# EAGLE design VCO-40106 (EAGLE 9.2.0)
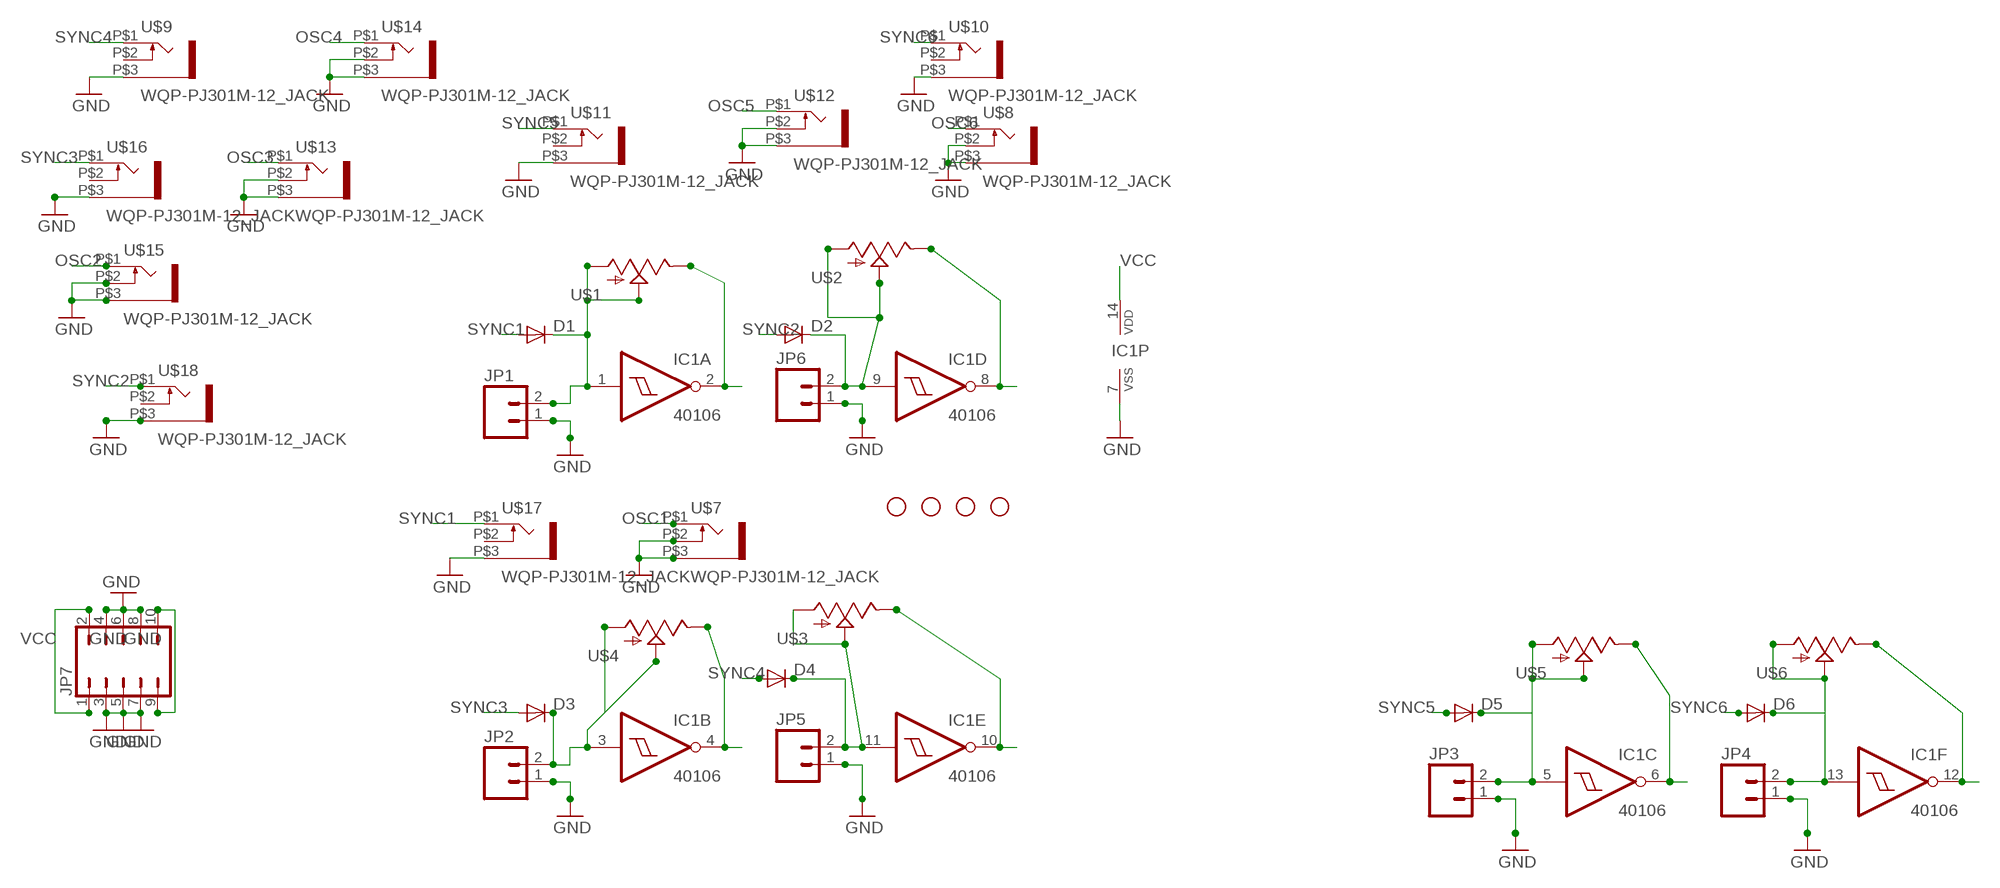
[diagram p0: schematic, sheet 1]

## Parts
D1  DIODE1N4148  [DIODE-1N4148]
D2  DIODE1N4148  [DIODE-1N4148]
D3  DIODE1N4148  [DIODE-1N4148]
D4  DIODE1N4148  [DIODE-1N4148]
D5  DIODE1N4148  [DIODE-1N4148]
D6  DIODE1N4148  [DIODE-1N4148]
IC1  40106  40106N  [DIL14]
JP1  M02  [1X02_LONGPADS]
JP2  M02  [1X02_LONGPADS]
JP3  M02  [1X02_LONGPADS]
JP4  M02  [1X02_LONGPADS]
JP5  M02  [1X02_LONGPADS]
JP6  M02  [1X02_LONGPADS]
JP7  JP5Q  [JP5Q]
JP8  STAND-OFF  [STAND-OFF]
JP9  STAND-OFF  [STAND-OFF]
JP10  STAND-OFF  [STAND-OFF]
JP11  STAND-OFF  [STAND-OFF]
U$1  POT  [ALPS_POT]
U$2  POT  [ALPS_POT]
U$3  POT  [ALPS_POT]
U$4  POT  [ALPS_POT]
U$5  POT  [ALPS_POT]
U$6  POT  [ALPS_POT]
U$7  WQP-PJ301M-12_JACK  [WQP-PJ301M-12_JACK]
U$8  WQP-PJ301M-12_JACK  [WQP-PJ301M-12_JACK]
U$9  WQP-PJ301M-12_JACK  [WQP-PJ301M-12_JACK]
U$10  WQP-PJ301M-12_JACK  [WQP-PJ301M-12_JACK]
U$11  WQP-PJ301M-12_JACK  [WQP-PJ301M-12_JACK]
U$12  WQP-PJ301M-12_JACK  [WQP-PJ301M-12_JACK]
U$13  WQP-PJ301M-12_JACK  [WQP-PJ301M-12_JACK]
U$14  WQP-PJ301M-12_JACK  [WQP-PJ301M-12_JACK]
U$15  WQP-PJ301M-12_JACK  [WQP-PJ301M-12_JACK]
U$16  WQP-PJ301M-12_JACK  [WQP-PJ301M-12_JACK]
U$17  WQP-PJ301M-12_JACK  [WQP-PJ301M-12_JACK]
U$18  WQP-PJ301M-12_JACK  [WQP-PJ301M-12_JACK]

## Nets
GND: IC1.7(P:VSS) JP1.1 JP2.1 JP3.1 JP4.1 JP5.1 JP6.1 JP7.3 JP7.4 JP7.5 JP7.6 JP7.7 JP7.8 U$7.P$2 U$7.P$3 U$8.P$2 U$8.P$3 U$9.P$3 U$10.P$3 U$11.P$3 U$12.P$2 U$12.P$3 U$13.P$2 U$13.P$3 U$14.P$2 U$14.P$3 U$15.P$2 U$15.P$3 U$16.P$3 U$17.P$3 U$18.P$3
N$1: D1.C IC1.1(A:I) JP1.2 U$1.P$2(S) U$1.P$3(A)
N$3: D3.C IC1.3(B:I) JP2.2 U$4.P$2(S) U$4.P$3(A)
N$5: D5.C IC1.5(C:I) JP3.2 U$5.P$2(S) U$5.P$3(A)
N$6: JP7.9 JP7.10
N$7: D2.C IC1.9(D:I) JP6.2 U$2.P$2(S) U$2.P$3(A)
N$18: D4.C IC1.11(E:I) JP5.2 U$3.P$2(S) U$3.P$3(A)
N$22: D6.C IC1.13(F:I) JP4.2 U$6.P$2(S) U$6.P$3(A)
OSC1: IC1.2(A:O) U$1.P$1(E) U$7.P$1
OSC2: IC1.4(B:O) U$4.P$1(E) U$15.P$1
OSC3: IC1.6(C:O) U$5.P$1(E) U$13.P$1
OSC4: IC1.8(D:O) U$2.P$1(E) U$14.P$1
OSC5: IC1.10(E:O) U$3.P$1(E) U$12.P$1
OSC6: IC1.12(F:O) U$6.P$1(E) U$8.P$1
SYNC1: D1.A U$17.P$1
SYNC2: D2.A U$18.P$1
SYNC3: D3.A U$16.P$1
SYNC4: D4.A U$9.P$1
SYNC5: D5.A U$11.P$1
SYNC6: D6.A U$10.P$1
VCC: IC1.14(P:VDD) JP7.1 JP7.2
Unconnected: U$9.P$2 U$10.P$2 U$11.P$2 U$16.P$2 U$17.P$2 U$18.P$2

## Library data of the parts
D1-D6 = SparkFun:DIODE: Diode These are standard reverse protection diodes and small signal diodes. SMA package can handle up to about 1A. SOD-323 can handle about 200mA. What the SOD-323 package when ordering, there are some mfgs out there that are 5-pin packages.
IC1 = 40xx:40106: Hex SCHMITT TRIGGER
JP1-JP6 = SparkFun:M02: Header 2 Standard 2-pin 0.1" header. Use with straight break away headers (SKU : PRT-00116), right angle break away headers (PRT-00553), swiss pins (PRT-00743), machine pins (PRT-00117), and female headers (PRT-00115). Molex polarized connector foot print use with SKU : PRT-08233 with associated crimp pins and housings.
JP7 = jumper:JP5Q: JUMPER
JP8-JP11 = SparkFun:STAND-OFF: Stand Off This is the mechanical footprint for a #4 phillips button head screw. Use the keepout ring to avoid running the screw head into surrounding components. SKU : PRT-00447
U$1-U$6 = SparkFun:POT
U$7-U$18 = thonkiconn:WQP-PJ301M-12_JACK

## Board
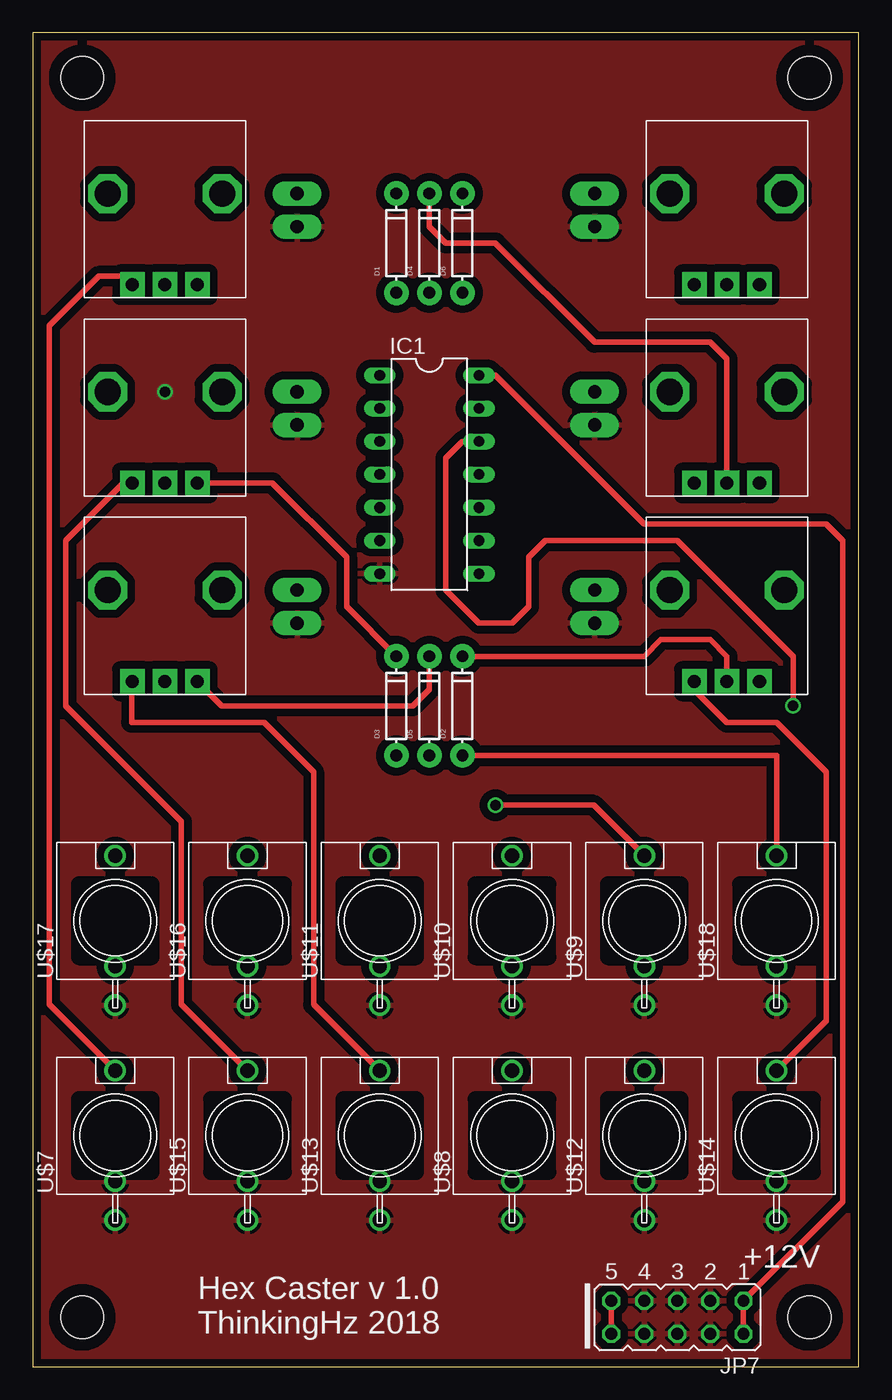
[diagram p1: board, top side]
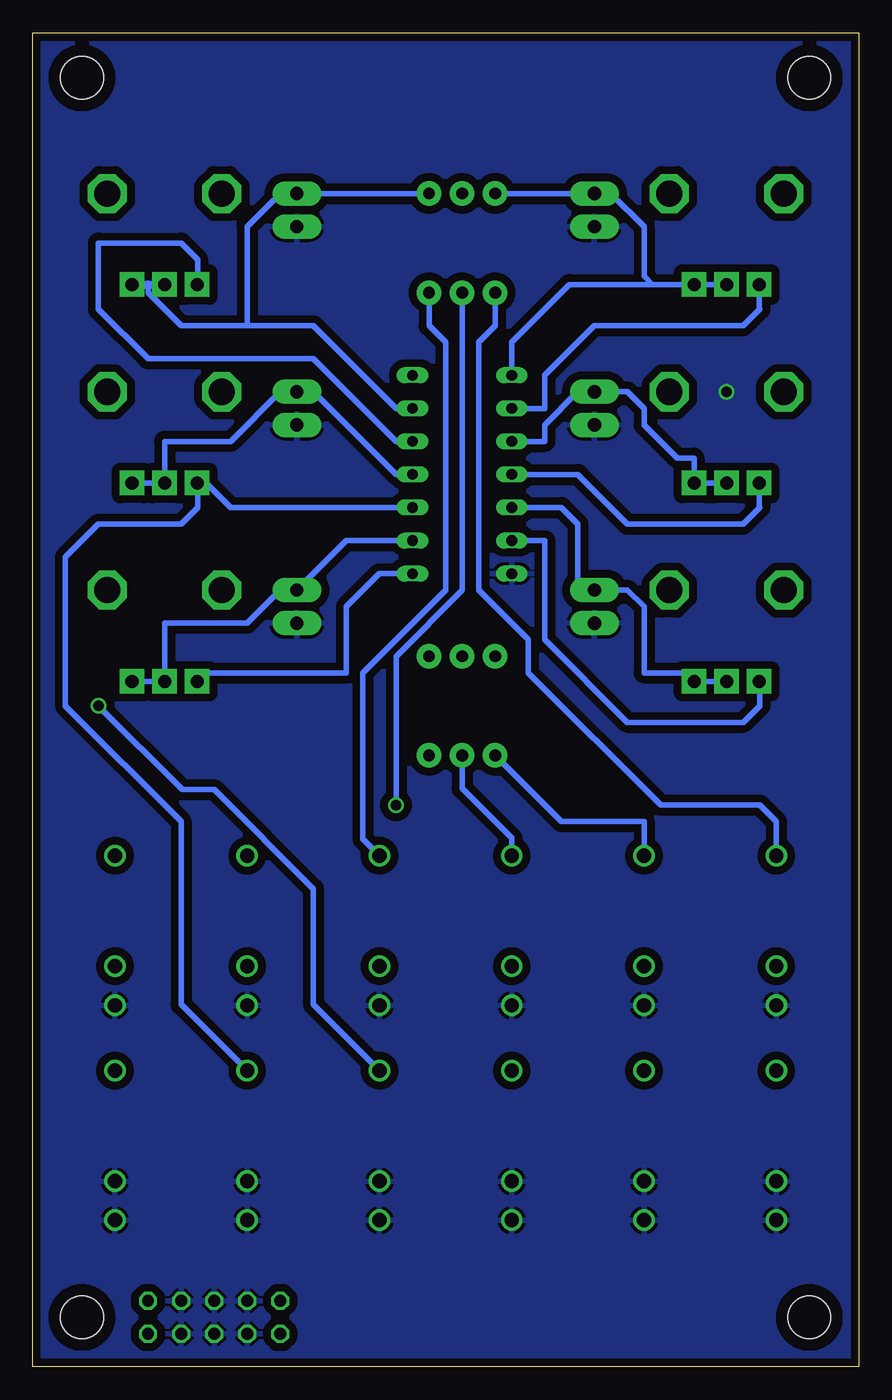
[diagram p2: board, bottom side, seen from below]

Size 63.48 x 102.54 mm. Coordinates in mm from the lower left corner, seen from the top.
Outline: 0,0 63.48,0 63.48,102.54 0,102.54 0,0
Copper layers (1*16): Top 0.035559375mm / dielectric 1.6mm / Bottom 0.035559375mm
Design rules "oshpark-2layer": minimum track width 6mil, minimum drill 10mil, track to track 6mil, track to pad 6mil, pad to pad 6mil, via to via 6mil, smd to smd 6mil, copper to edge 15mil, drill to drill 6mil, minimum pad ring 5mil, minimum via ring 5mil, stop-mask expansion 2.5mil, vias tented up to drill 0mil, thermal gap 10mil

### Footprints (pad centres in the part's own frame; a part is rotated, then mirrored left to right if it is on the bottom)
DIODE-1N4148 = drill 0.9 pad 1.88: A -3.81,0; C 3.81,0
DIL14 = drill 0.813 long: 1 -7.62,-3.81; 2 -5.08,-3.81; 3 -2.54,-3.81; 4 0,-3.81; 5 2.54,-3.81; 6 5.08,-3.81; 7 7.62,-3.81; 8 7.62,3.81; 9 5.08,3.81; 10 2.54,3.81; 11 0,3.81; 12 -2.54,3.81; 13 -5.08,3.81; 14 -7.62,3.81
1X02_LONGPADS = drill 1.016 pad 1.88 long: 1 0,0; 2 2.54,0
JP5Q = drill 0.914 octagon: 1 -5.08,-1.27; 2 -5.08,1.27; 3 -2.54,-1.27; 4 -2.54,1.27; 5 0,-1.27; 6 0,1.27; 7 2.54,-1.27; 8 2.54,1.27; 9 5.08,-1.27; 10 5.08,1.27
STAND-OFF = hole 3.302: 0,0
ALPS_POT = drill 1 pad 1.88 square: P$1 7,-2.5; P$2 7,0; P$3 7,2.5 | drill 2 octagon: P$4 0,-4.4; P$5 0,4.4
WQP-PJ301M-12_JACK = drill 1.1: P$1 0,5; P$2 0,-3.5; P$3 0,-6.5

### Placement (x,y rotation side)
D1  27.94,86.36 90 top
D2  33.02,50.8 90 top
D3  27.94,50.8 90 top
D4  30.48,86.36 90 top
D5  30.48,50.8 90 top
D6  33.02,86.36 90 top
IC1  30.48,68.58 270 top
JP1  20.32,87.63 90 top
JP2  20.32,72.39 90 top
JP3  20.32,57.15 90 top
JP4  43.18,87.63 90 top
JP5  43.18,72.39 90 top
JP6  43.18,57.15 90 top
JP7  49.53,3.81 180 top
JP8  3.81,3.81 0 top
JP9  59.69,3.81 0 top
JP10  3.81,99.06 0 top
JP11  59.69,99.06 0 top
U$1  10.16,90.17 270 top
U$2  53.34,59.69 270 top
U$3  53.34,74.93 270 top
U$4  10.16,74.93 270 top
U$5  10.16,59.69 270 top
U$6  53.34,90.17 270 top
U$7  6.35,17.78 0 top
U$8  36.83,17.78 0 top
U$9  46.99,34.29 0 top
U$10  36.83,34.29 0 top
U$11  26.67,34.29 0 top
U$12  46.99,17.78 0 top
U$13  26.67,17.78 0 top
U$14  57.15,17.78 0 top
U$15  16.51,17.78 0 top
U$16  16.51,34.29 0 top
U$17  6.35,34.29 0 top
U$18  57.15,34.29 0 top

### Tracks (layer width: path | path; a pad name or v marks a point on that pad's centre or on a via)
GND  (via drill 0.8)
  other vias: 10.16,74.93
  pour Top (isolate 0.61): 0,102.87 63.5,102.87 63.5,0 0,0
  pour Bottom (isolate 0.61): 0,102.87 63.5,102.87 63.5,0 0,0
N$1
  Bottom 0.406: 15.86,83.17 16.51,83.82 16.51,87.63 19.05,90.17 JP1.2 D1.C | 15.86,83.17 U$1.P$3 U$1.P$2 | IC1.1 26.67,78.74 22.24,83.17 15.86,83.17
N$3
  Top 0.406: D3.C 24.13,58.42 24.13,62.23 18.43,67.93 U$4.P$3
  Bottom 0.406: IC1.3 24.13,71.12 24.13,72.39 21.59,74.93 JP2.2 17.78,74.93 16.51,73.66 16.51,72.39 13.97,69.85 12.7,69.85 12.66,69.81 U$4.P$3 U$4.P$2
N$5
  Top 0.406: D5.C 30.48,52.07 29.21,50.8 14.55,50.8 U$5.P$3
  Bottom 0.406: U$5.P$2 U$5.P$3 13.31,53.34 16.51,53.34 16.51,58.42 17.78,59.69 JP3.2 21.59,59.69 21.59,64.77 22.86,66.04 IC1.5
N$6
  Top 0.406: JP7.9 JP7.10
N$7
  Top 0.406: D2.C 46.99,54.61 48.26,55.88 52.07,55.88 53.34,54.61 U$2.P$2
  Bottom 0.406: IC1.9 39.37,63.5 JP6.2 44.45,59.69 46.99,57.15 53.34,57.15 U$2.P$2 U$2.P$3
N$18
  Top 0.406: D4.C 30.48,87.63 31.75,86.36 35.56,86.36 43.18,78.74 52.07,78.74 53.34,77.47 U$3.P$2
  Bottom 0.406: U$3.P$3 U$3.P$2 53.34,71.12 48.26,71.12 44.45,74.93 JP5.2 41.91,74.93 35.56,68.58 IC1.11
N$22
  Bottom 0.406: 46.99,80.01 41.91,80.01 35.56,73.66 IC1.13 | 46.99,80.01 52.07,80.01 54.61,82.55 54.61,83.17 | 46.99,80.01 46.99,87.63 44.45,90.17 JP4.2 D6.C
  Bottom 0.61: U$6.P$3 54.61,83.17 U$6.P$2
OSC1
  Top 0.406: U$7.P$1 1.27,27.86 1.27,80.01 5.08,83.82 7.62,83.82 7.66,83.78 U$1.P$1
  Bottom 0.406: IC1.2 24.13,73.66 24.13,76.2 20.32,80.01 8.89,80.01 7.62,81.28 7.66,81.32 U$1.P$1
OSC2
  Top 0.406: U$15.P$1 11.43,27.86 11.43,41.91 2.54,50.8 2.54,63.5 6.97,67.93 U$4.P$1
  Bottom 0.406: U$4.P$1 7.66,66.08 7.62,66.04 8.89,64.77 17.78,64.77 21.59,68.58 IC1.4
OSC3
  Top 0.406: U$13.P$1 21.59,27.86 21.59,45.72 17.78,49.53 7.62,49.53 7.62,52.65 U$5.P$1
  Bottom 0.406: IC1.6 24.13,63.5 24.13,55.88 17.78,49.53 8.89,49.53 7.62,50.8 7.62,52.65 U$5.P$1
OSC4
  Top 0.406: U$14.P$1 60.96,26.59 60.96,45.72 57.15,49.53 53.34,49.53 50.84,52.03 U$2.P$1
  Bottom 0.406: IC1.8 36.83,60.96 39.37,58.42 39.37,53.34 50.19,53.34 U$2.P$1
OSC5
  Bottom 0.406: U$3.P$1 50.8,67.93 | 50.8,67.93 50.15,67.93 48.26,66.04 IC1.10 | U$12.P$1 52.07,27.86 52.07,41.91 60.96,50.8 60.96,62.23 58.42,64.77 52.07,64.77 50.8,66.04 50.8,67.93
OSC6  (via drill 0.8)
  Top 0.406: IC1.12 33.02,71.12 31.75,69.85 31.75,59.69 34.29,57.15 36.83,57.15 38.1,58.42 38.1,62.23 39.37,63.5 49.53,63.5 58.42,54.61 58.42,52.07 v58.42,50.8
  Bottom 0.406: IC1.12 35.56,71.12 41.91,77.47 54.61,77.47 58.42,81.28 58.42,86.36 52.07,86.36 50.8,85.09 50.8,83.21 U$6.P$1 | U$8.P$1 41.91,27.86 41.91,36.75 49.53,44.37 51.99,44.37 v58.42,50.8
SYNC1
  Bottom 0.406: D1.A 27.94,80.01 29.21,78.74 29.21,59.69 25.4,55.88 25.4,53.34 15.24,43.18 7.62,43.18 6.35,41.91 U$17.P$1
SYNC2
  Top 0.406: D2.A 57.15,46.99 U$18.P$1
SYNC3
  Bottom 0.406: D3.A 22.86,41.91 16.51,41.91 U$16.P$1
SYNC4  (via drill 0.8)
  Top 0.406: U$9.P$1 43.1,43.18 v35.56,43.18
  Bottom 0.406: D4.A 30.48,59.69 35.56,54.61 v35.56,43.18
SYNC5
  Bottom 0.406: D5.A 30.48,44.45 26.67,40.64 U$11.P$1
SYNC6
  Bottom 0.406: D6.A 33.02,80.01 31.75,78.74 31.75,59.69 38.1,53.34 38.1,40.56 U$10.P$1
VCC
  Top 0.406: JP7.2 JP7.1 62.23,12.7 62.23,63.5 60.96,64.77 46.99,64.77 35.56,76.2 IC1.14

### Text on the board
tNames: +12V | Hex Caster v 1.0 / ThinkingHz 2018 | |